# Altium project Power_PCB.PrjPcb
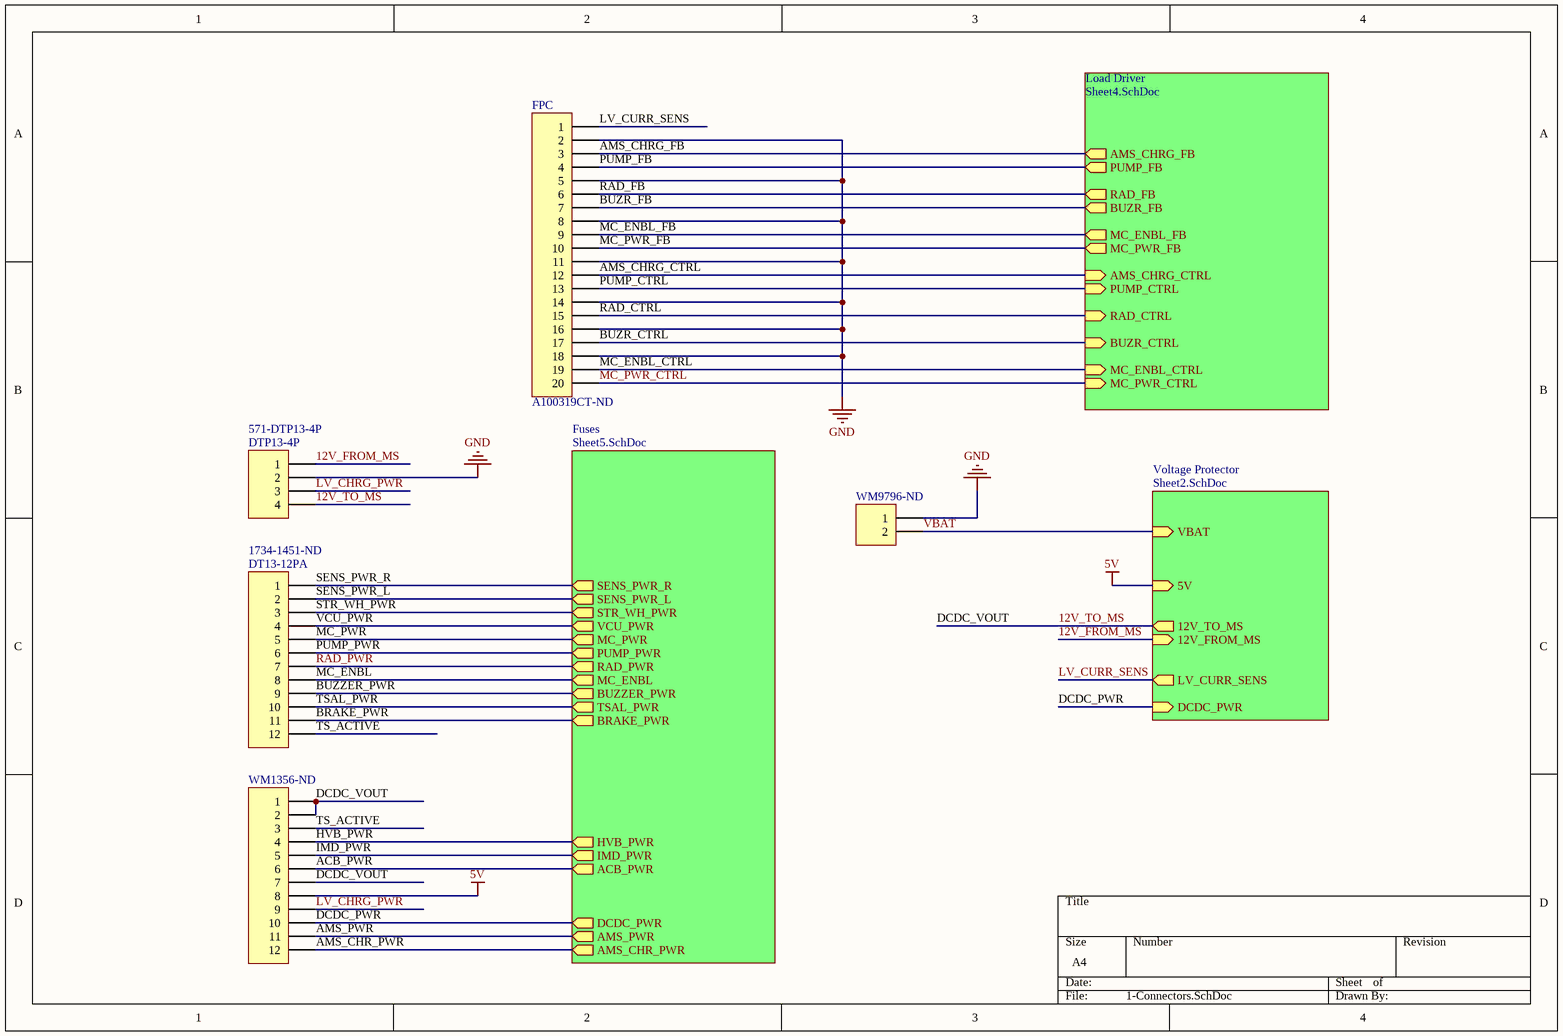
[diagram p0: 1-Connectors.SchDoc]
4 sheets, 95 parts. Net scope: global (net labels, ports and power ports of the same name join across sheets).
Board files: 2018_ACU_LVPWR_rev0.PcbDoc, 2018_ACU_LVPWR_rev1.PcbDoc, 2019_ACU_LVPWR_rev0.PcbDoc
Sheets:
  1-Connectors.SchDoc
  2-VoltProtector_CurrSens.SchDoc
  3-LoadDrivers.SchDoc
  4-Fuses.SchDoc

## Sheet 1-Connectors.SchDoc
size A4

### Parts
DT13-12PA  Supplier Part Number 2: 1734-1451-ND  [DT13-12PA]  (hidden comment: DT13-12PA)
DTP13-4P  Supplier Part Number 1: 571-DTP13-4P  [DTP13-4P]  (hidden comment: DTP13-4P)
FPC  Header 20  [A100319CT-ND]  (value not drawn)
WM1356-ND  Header 12  [WM1356-ND]  (value not drawn)
WM9796-ND  WM9796-ND  [WM9796-ND]  (value not drawn)

### Sub-sheets
Fuses = Sheet5.SchDoc (file not in this document): MC_ENBL (out), MC_PWR (out), VCU_PWR (out), BRAKE_PWR (out), BUZZER_PWR (out), TSAL_PWR (out), PUMP_PWR (out), ACB_PWR (out), IMD_PWR (out), AMS_CHR_PWR (out), HVB_PWR (out), AMS_PWR (out), STR_WH_PWR (out), SENS_PWR_L (out), SENS_PWR_R (out), RAD_PWR (out), DCDC_PWR (out)
Load Driver = Sheet4.SchDoc (file not in this document): RAD_CTRL (in), PUMP_CTRL (in), BUZR_FB (out), RAD_FB (out), AMS_CHRG_FB (out), PUMP_FB (out), MC_PWR_FB (out), MC_ENBL_FB (out), BUZR_CTRL (in), MC_ENBL_CTRL (in), AMS_CHRG_CTRL (in), MC_PWR_CTRL (in)
Voltage Protector = Sheet2.SchDoc (file not in this document): 12V_TO_MS (out), LV_CURR_SENS (out), 5V (in), 12V_FROM_MS (in), VBAT (in), DCDC_PWR (in)

### Nets
5V: WM1356-ND.8 ; sheet Voltage Protector/5V
GND: DTP13-4P.2 FPC.2 FPC.5 FPC.8 FPC.11 FPC.14 FPC.16 FPC.18 WM9796-ND.1
12V_FROM_MS: DTP13-4P.1 ; sheet Voltage Protector/12V_FROM_MS
12V_TO_MS: DTP13-4P.4 WM1356-ND.1 WM1356-ND.2 WM1356-ND.7 ; sheet Voltage Protector/12V_TO_MS  [also labelled DCDC_VOUT]
ACB_PWR: WM1356-ND.6 ; sheet Fuses/ACB_PWR
AMS_CHR_PWR: WM1356-ND.12 ; sheet Fuses/AMS_CHR_PWR
AMS_CHRG_CTRL: FPC.12 ; sheet Load Driver/AMS_CHRG_CTRL
AMS_CHRG_FB: FPC.3 ; sheet Load Driver/AMS_CHRG_FB
AMS_PWR: WM1356-ND.11 ; sheet Fuses/AMS_PWR
BRAKE_PWR: DT13-12PA.11 ; sheet Fuses/BRAKE_PWR
BUZR_CTRL: FPC.17 ; sheet Load Driver/BUZR_CTRL
BUZR_FB: FPC.7 ; sheet Load Driver/BUZR_FB
BUZZER_PWR: DT13-12PA.9 ; sheet Fuses/BUZZER_PWR
DCDC_PWR: WM1356-ND.10 ; sheet Voltage Protector/DCDC_PWR, sheet Fuses/DCDC_PWR
HVB_PWR: WM1356-ND.4 ; sheet Fuses/HVB_PWR
IMD_PWR: WM1356-ND.5 ; sheet Fuses/IMD_PWR
LV_CHRG_PWR: DTP13-4P.3 WM1356-ND.9
LV_CURR_SENS: FPC.1 ; sheet Voltage Protector/LV_CURR_SENS
MC_ENBL: DT13-12PA.8 ; sheet Fuses/MC_ENBL
MC_ENBL_CTRL: FPC.19 ; sheet Load Driver/MC_ENBL_CTRL
MC_ENBL_FB: FPC.9 ; sheet Load Driver/MC_ENBL_FB
MC_PWR: DT13-12PA.5 ; sheet Fuses/MC_PWR
MC_PWR_CTRL: FPC.20 ; sheet Load Driver/MC_PWR_CTRL
MC_PWR_FB: FPC.10 ; sheet Load Driver/MC_PWR_FB
PUMP_CTRL: FPC.13 ; sheet Load Driver/PUMP_CTRL
PUMP_FB: FPC.4 ; sheet Load Driver/PUMP_FB
PUMP_PWR: DT13-12PA.6 ; sheet Fuses/PUMP_PWR
RAD_CTRL: FPC.15 ; sheet Load Driver/RAD_CTRL
RAD_FB: FPC.6 ; sheet Load Driver/RAD_FB
RAD_PWR: DT13-12PA.7 ; sheet Fuses/RAD_PWR
SENS_PWR_L: DT13-12PA.2 ; sheet Fuses/SENS_PWR_L
SENS_PWR_R: DT13-12PA.1 ; sheet Fuses/SENS_PWR_R
STR_WH_PWR: DT13-12PA.3 ; sheet Fuses/STR_WH_PWR
TS_ACTIVE: DT13-12PA.12 WM1356-ND.3
TSAL_PWR: DT13-12PA.10 ; sheet Fuses/TSAL_PWR
VBAT: WM9796-ND.2 ; sheet Voltage Protector/VBAT
VCU_PWR: DT13-12PA.4 ; sheet Fuses/VCU_PWR

### Library data of the parts
DT13-12PA WM1356-ND = Header 12: Header, 12-Pin; LatestRevisionDate: 17-Jul-2002; LatestRevisionNote: Re-released for DXP Platform.; Publisher: Altium Limited; Supplier 1: Digi-Key
  DT13-12PA: Supplier Part Number 1: DT13-12PA; Supplier 2: Digi-Key
  WM1356-ND: Supplier Part Number 1: WM1356-ND
DTP13-4P = Header 4: Header, 4-Pin; LatestRevisionDate: 17-Jul-2002; LatestRevisionNote: Re-released for DXP Platform.; Publisher: Altium Limited; Supplier 1: Mouser
FPC = Header 20: Header, 20-Pin; LatestRevisionDate: 17-Jul-2002; LatestRevisionNote: Re-released for DXP Platform.; Publisher: Altium Limited; Supplier 1: Digi-Key; Supplier Part Number 1: A100319CT-ND
WM9796-ND = Header 2: Header, 2-Pin; LatestRevisionDate: 17-Jul-2002; LatestRevisionNote: Re-released for DXP Platform.; Publisher: Altium Limited; Supplier 1: Digi-Key; Supplier 2: Digi-Key; Supplier Part Number 2: WM9796-ND

## Sheet 2-VoltProtector_CurrSens.SchDoc
size A4
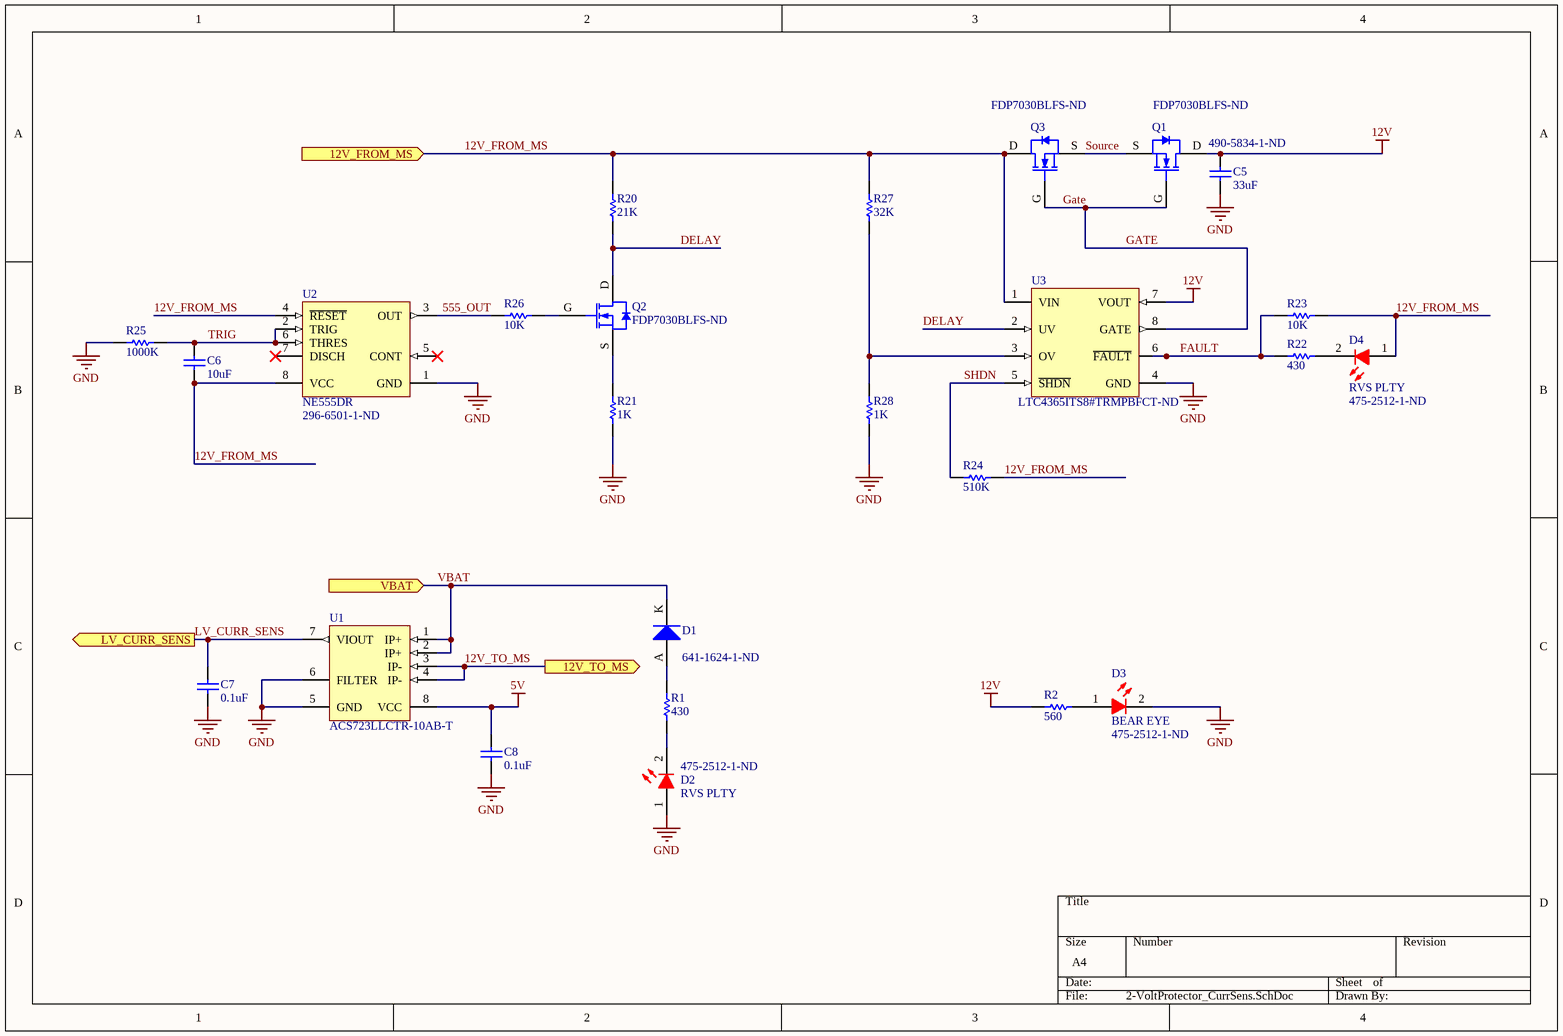
[diagram p1: 2-VoltProtector_CurrSens.SchDoc]

### Parts
C5  value 33uF  Supplier Part Number 1: 490-5834-1-ND  [2J-Lead 6.1 x 5.3]  (hidden comment: Cap Semi)
C6  value 10uF  [2J-Lead 6.1 x 5.3]  (hidden comment: Cap Semi)
C7  value 0.1uF  [1608[0603]]  (hidden comment: Cap Semi)
C8  value 0.1uF  [1608[0603]]  (hidden comment: Cap Semi)
D1  Supplier Part Number 1: 641-1624-1-ND  [SOD-123]
D2  RVS PLTY  Supplier Part Number 1: 475-2512-1-ND  [TOSH-0603LED_RED_V]
D3  BEAR EYE  Supplier Part Number 1: 475-2512-1-ND  [TOSH-0603LED_RED_V]
D4  RVS PLTY  Supplier Part Number 1: 475-2512-1-ND  [TOSH-0603LED_RED_V]
Q1  Supplier Part Number 1: FDP7030BLFS-ND  [TO220V-GDS]
Q2  Supplier Part Number 1: FDP7030BLFS-ND  [TO220V-GDS]
Q3  Supplier Part Number 1: FDP7030BLFS-ND  [TO220V-GDS]
R1  430  [RESC0603(1608)_L]
R2  560  [RESC0603(1608)_L]
R20  21K  [RESC0603(1608)_L]
R21  1K  [RESC0603(1608)_L]
R22  430  [RESC0603(1608)_L]
R23  10K  [RESC0603(1608)_L]
R24  510K  [RESC0603(1608)_L]
R25  1000K  [RESC0603(1608)_L]
R26  10K  [RESC0603(1608)_L]
R27  32K  [RESC0603(1608)_L]
R28  1K  [RESC0603(1608)_L]
U1  ACS723LLCTR-10AB-T  [ALEG-LC-8_V]
U2  NE555DR  Supplier Part Number 1: 296-6501-1-ND  [D0008A_M]
U3  Supplier Part Number 1: LTC4365ITS8#TRMPBFCT-ND  [LT-TS8-8-TSOT-23_V]  (hidden comment: LTC4365ITS8#TRMPBF)

### Ports
12V_FROM_MS (in), 12V_TO_MS (out), LV_CURR_SENS (out), VBAT (in)

### Nets
5V: C8.2 U1.8(VCC)
12V: C5.1 Q1.D R2.1 U3.7(VOUT)
GND: C5.2 C7.1 C8.1 D2.1(A) D3.2(K) R21.2 R25.2 R28.1 U1.5(GND) U1.6(FILTER) U2.1(GND) U3.4(GND)
12V_FROM_MS: C6.2 D4.1(A) Q3.D R20.1 R23.1 R24.1 R27.2 U2.4(~{RESET}) U2.8(VCC) U3.1(VIN) ; port 12V_FROM_MS
12V_TO_MS: U1.3(IP-) U1.4(IP-) ; port 12V_TO_MS
555_OUT: R26.2 U2.3(OUT)
DELAY: Q2.D R20.2 U3.2(UV)
FAULT: R22.1 R23.2 U3.6(~{FAULT})
GATE: Q1.G Q3.G U3.8(GATE)
LV_CURR_SENS: C7.2 U1.7(VIOUT) ; port LV_CURR_SENS
SHDN: R24.2 U3.5(~{SHDN})
Source: Q1.S Q3.S
TRIG: C6.1 R25.1 U2.2(TRIG) U2.6(THRES)
VBAT: D1.K U1.1(IP+) U1.2(IP+) ; port VBAT
NetD1_A: D1.A R1.2
NetD2_2: D2.2(K) R1.1
NetD3_1: D3.1(A) R2.2
NetD4_2: D4.2(K) R22.2
NetQ2_G: Q2.G R26.1
NetQ2_S: Q2.S R21.1
NetR27_1: R27.1 R28.2 U3.3(OV)

Not connected (* = marked no-connect by the designer): U2 5(CONT)* 7(DISCH)*

### Library data of the parts
C5-C8 = Cap Semi: Capacitor (Semiconductor SIM Model); Published: 8-Jun-2000; LatestRevisionDate: 29-May-2009; LatestRevisionNote: IPC-7351 Footprint Added.; PackageReference: C1206; Publisher: Altium Limited; PackageDescription: Chip Capacitor
  C5: Supplier 1: Digi-Key
  C7 C8: Supplier 1: Digi-Key; Supplier 2: Digi-Key; Supplier Part Number 2: 490-14359-1-ND
D1 = Diode 1N4003: 1 Amp General Purpose Rectifier; Published: 8-Jun-2000; LatestRevisionDate: 17-Jul-2002; LatestRevisionNote: Re-released for DXP Platform.; DatasheetVersion: 1998; PackageVersion: Aug-1999; PackageReference: DO-41; Publisher: Altium Limited; PackageDescription: Diode, Axial; Body 5.2 x 2.7 mm (LxDia. max), Lead Dia. 0.86 mm (max); Code_JEDEC: DO-204-AL; ComponentLink1Description: Manufacturer Link; ComponentLink1URL: http://www.fairchildsemi.com/; ComponentLink2Description: Datasheet; ComponentLink2URL: http://www.fairchildsemi.com/ds/1N%2F1N4001.pdf; Supplier 1: Digi-Key
D2-D4 = CMP-0444-00001-1: LED, Red 0603 (1608) 63mCd; Manufacturer: Toshiba; PartNumber: TLSU1008A(T04); Forward Current: 25 mA; Power Dissipation: 60 mW; Packing Type: Reel; Reverse Voltage: 4 V; Mounting Technology: Surface Mount; PackageDescription: 2-Pin SMT LED, 1.6 x 0.8 mm Pitch; ComponentLink1URL: http://www.toshiba-components.com/; ComponentLink1Description: Manufacturer URL; PackageReference: 0603LED_RED; ComponentLink2URL: http://www.semicon.toshiba.co.jp/info/docget.jsp?type=datasheet&lang=en&pid=TLSU1008A(T04); ComponentLink2Description: Datasheet; DatasheetVersion: Aug-08; Storage Temperature: -40 to 100 degC; Supplier 1: Digi-Key
Q1-Q3 = CMP-1058-00860-1: Power MOSFET, 40 V, 167 A, Single N-Channel, 3-Pin TO-220, Pb-Free, Tube; Qrr Typ (nC): 140; Channel Polarity: N Channel; Crss Typ (pF): 450; Ciss Typ (pF): 4300; Coss Typ (pF): 1075; ID Max (A): 167; PackageDescription: 3-Pin Flange Mount, Vertical Straight Lead, Body 9.97 x 4.445 mm, Pitch 2.54 mm; Configuration: Single; PackageVersion: Rev. AG, 09/2011; RoHS: Pb-Free; PackageReference: TO-220-3-221A-09; Package Type: TO-220-3; DatasheetVersion: Rev. 7; Packing: Tube; Mounting Technology: Through Hole; Supplier 1: Digi-Key
R1 R2 R20-R28 = CMP-1591-00001-1: 0603 (1608 Metric) Chip Resistor; Case-Metric: 1608; Case-EIA: 0603; PackageReference: RESC0603(1608)
  R1 R22: Supplier 1: Digi-Key; Supplier Part Number 1: P430BZCT-ND
  R2: Supplier 1: Digi-Key; Supplier Part Number 1: P560BZCT-ND
  R23 R26: Supplier 1: Digi-Key; Supplier Part Number 1: 311-10KGRCT-ND
  R25 R27 R28: Supplier 1: Digi-Key
U1 = CMP-0826-00001-1: Linear Current Sensor IC, 4.5 to 5.5 V Supply Voltage, 10 mA Supply Current, -40 to 85 degC, 8-Pin SOIC (LC), RoHS, Tape and Reel; Manufacturer: Allegro Microsystems; PartNumber: ACS712ELCTR-20A-T; CLOAD: 10 nF Max.; ICC: 10 mA; F: 80 kHz; RLOAD: 4.7 kOhm Min.; Optimized Accuracy Range: +/- 20 A; TR: 3.5 us; Sensitivity Sens: 100 mV/A Typ.; Operating Temperature Range: -40 to 85 degC; ComponentLink2URL: http://www.allegromicro.com/~/media/Files/Datasheets/ACS712-Datasheet.ashx; ComponentLink1Description: Manufacturer URL; VCC: 4.5 to 5.5 V; Mounting Technology: Surface Mount; DatasheetVersion: Rev. 15; ComponentLink2Description: Datasheet; ComponentLink1URL: http://www.allegromicro.com/; PackageDescription: 8-Pin SOIC, Body 4.9 x 3.9 mm, Pitch 1.27 mm; PackageReference: LC-8; RoHS: TRUE; Packing: Tape and Reel; Supplier 1: Digi-Key; Supplier Part Number 1: 620-1190-1-ND
U2 = CMP-1685-00007-1: Precision Timer, 4.5 to 16 V, 0 to 70 degC, 8-Pin SOIC (D8), Green (RoHS & no Sb/Br), Tape and Reel; Forward Voltage: 450 mV; Forward Current: 1 A; Max Surge Current: 30 A; Peak Reverse Current: 500 uA; Case\Package: SMA; PackageReference: D0008A; Width: 2.84 mm; PackageDescription: 8-Pin Small Outline Integrated Circuit, Body 4.9 x 3.9 mm, Pitch 1.27 mm; DatasheetVersion: SLFS022I, 09/2014; ComponentLink2Description: Datasheet; Package Quantity: 1; REACH SVHC: Unknown; Radiation Hardening: No; Height: 2.44 mm; Code_JEDEC: MS-012; Pins: 2; ComponentLink1Description: Manufacturer URL; ComponentLink3Description: Package Specification; ComponentLink3URL: http://www.ti.com/lit/ml/msoi002j/msoi002j.pdf; Length: 4.57 mm; ComponentLink1URL: http://www.ti.com/; Mount: Surface Mount; PackageVersion: 4040047-3/M, 06/2011; ComponentLink2URL: http://www.ti.com/general/docs/lit/getliterature.tsp?genericPartNumber=NE555&fileType=pdf; RoHSCompliant: true; Max Operating Temperature: 125 degC; Packaging: Cut Tape; Min Operating Temperature: -55 degC; Supplier 1: Digi-Key
U3 = CMP-0474-00861-1: UV, OV and Reverse Supply Protection Controller, 2.5 to 34 V Vin, 8-pin SOT23 (TS8-8), -40 to 85 degC, Pb-Free, Mini Tape and Reel; Manufacturer: Linear Technology; Fault: yes; Fast Comparator: no; Extended Temp: C, I, H; Circuit Breakers(#): 1; RoHS: TRUE; ComponentLink2URL: http://cds.linear.com/docs/en/datasheet/4365f.pdf; PartNumber: LTC4365ITS8#TRMPBF; ComponentLink3Description: Package Specification; Power Good: no; Packing: Mini Tape and Reel; ComponentLink2Description: Datasheet; Vin Range: 2.5 to 34 V; Active Limiting: no; Foldback: no; Reset: no; ComponentLink3URL: http://cds.linear.com/docs/en/packaging/SOT_8_05-08-1637.pdf; PackageVersion: Rev. A, 08/2010; Code_JEDEC: MO-193; ComponentLink1Description: Manufacturer URL; Mounting Technology: Surface Mount; ComponentLink1URL: http://www.linear.com/; PackageDescription: 8-Pin Plastic TSOT-23, Body 2.9 x 1.63 mm, Pitch 0.65 mm; PackageReference: TS8-8; Supplier 1: Digi-Key

## Sheet 3-LoadDrivers.SchDoc
size A4
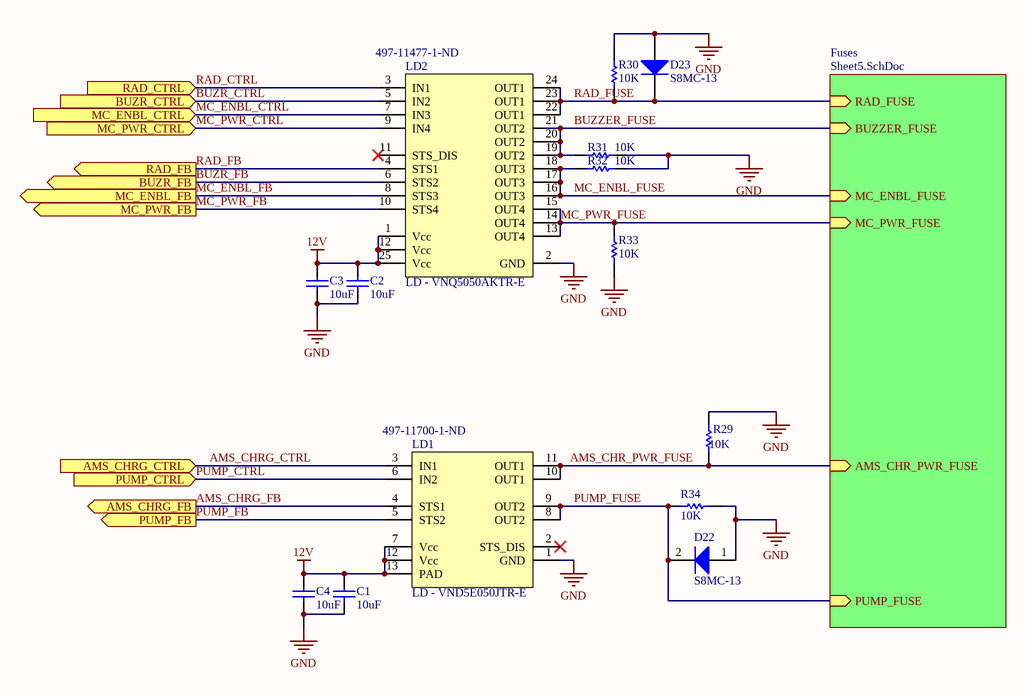
[diagram p2: 3-LoadDrivers.SchDoc]

### Parts
C1  value 10uF  [1608[0603]]  (hidden comment: Cap Semi)
C2  value 10uF  [1608[0603]]  (hidden comment: Cap Semi)
C3  value 10uF  [1608[0603]]  (hidden comment: Cap Semi)
C4  value 10uF  [1608[0603]]  (hidden comment: Cap Semi)
D22  S8MC-13  [S8MC-13]
D23  S8MC-13  [S8MC-13]
LD1  LD - VND5E050JTR-E  Supplier Part Number 1: 497-11700-1-ND
LD2  LD - VNQ5050AKTR-E  Supplier Part Number 1: 497-11477-1-ND  [24-SOP (0.295", 7.50mm Width) Exposed Pad]
R29  10K  [RESC0603(1608)_L]
R30  10K  [RESC0603(1608)_L]
R31  10K  [RESC0603(1608)_L]
R32  10K  [RESC0603(1608)_L]
R33  10K  [RESC0603(1608)_L]
R34  10K  [RESC0603(1608)_L]

### Sub-sheets
Fuses = Sheet5.SchDoc (file not in this document): RAD_FUSE (in), PUMP_FUSE (in), MC_PWR_FUSE (in), MC_ENBL_FUSE (in), BUZZER_FUSE (in), AMS_CHR_PWR_FUSE (in)

### Ports
AMS_CHRG_CTRL (in), AMS_CHRG_FB (out), BUZR_CTRL (in), BUZR_FB (out), MC_ENBL_CTRL (in), MC_ENBL_FB (out), MC_PWR_CTRL (in), MC_PWR_FB (out), PUMP_CTRL (in), PUMP_FB (out), RAD_CTRL (in), RAD_FB (out)

### Nets
12V: C1.2 C2.2 C3.2 C4.2 LD1.7(Vcc) LD1.12(Vcc) LD1.13(PAD) LD2.1(Vcc) LD2.12(Vcc) LD2.25(Vcc)
GND: C1.1 C2.1 C3.1 C4.1 D22.1(A) D23.1(A) LD1.1(GND) LD2.2(GND) R29.2 R30.2 R31.2 R32.2 R33.1 R34.1
AMS_CHR_PWR_FUSE: LD1.10(OUT1) LD1.11(OUT1) R29.1 ; sheet Fuses/AMS_CHR_PWR_FUSE
AMS_CHRG_CTRL: LD1.3(IN1) ; port AMS_CHRG_CTRL
AMS_CHRG_FB: LD1.4(STS1) ; port AMS_CHRG_FB
BUZR_CTRL: LD2.5(IN2) ; port BUZR_CTRL
BUZR_FB: LD2.6(STS2) ; port BUZR_FB
BUZZER_FUSE: LD2.19(OUT2) LD2.20(OUT2) LD2.21(OUT2) R31.1 ; sheet Fuses/BUZZER_FUSE
MC_ENBL_CTRL: LD2.7(IN3) ; port MC_ENBL_CTRL
MC_ENBL_FB: LD2.8(STS3) ; port MC_ENBL_FB
MC_ENBL_FUSE: LD2.16(OUT3) LD2.17(OUT3) LD2.18(OUT3) R32.1 ; sheet Fuses/MC_ENBL_FUSE
MC_PWR_CTRL: LD2.9(IN4) ; port MC_PWR_CTRL
MC_PWR_FB: LD2.10(STS4) ; port MC_PWR_FB
MC_PWR_FUSE: LD2.13(OUT4) LD2.14(OUT4) LD2.15(OUT4) R33.2 ; sheet Fuses/MC_PWR_FUSE
PUMP_CTRL: LD1.6(IN2) ; port PUMP_CTRL
PUMP_FB: LD1.5(STS2) ; port PUMP_FB
PUMP_FUSE: D22.2(K) LD1.8(OUT2) LD1.9(OUT2) R34.2 ; sheet Fuses/PUMP_FUSE
RAD_CTRL: LD2.3(IN1) ; port RAD_CTRL
RAD_FB: LD2.4(STS1) ; port RAD_FB
RAD_FUSE: D23.2(K) LD2.22(OUT1) LD2.23(OUT1) LD2.24(OUT1) R30.1 ; sheet Fuses/RAD_FUSE

Not connected (* = marked no-connect by the designer): LD1 2(STS_DIS)*; LD2 11(STS_DIS)*

### Library data of the parts
C1-C4 = Cap Semi: Capacitor (Semiconductor SIM Model); Published: 8-Jun-2000; LatestRevisionDate: 29-May-2009; LatestRevisionNote: IPC-7351 Footprint Added.; PackageReference: C1206; Publisher: Altium Limited; PackageDescription: Chip Capacitor; Supplier 1: Digi-Key; Supplier Part Number 1: 490-10991-1-ND
D22 D23 = Diode: Default Diode; Supplier 1: Digi-Key; Supplier Part Number 1: S8MCDICT-ND
LD1 = LOAD DRIVER - VND5E050JTR-E: Supplier 1: Digi-Key
LD2 = LOAD DRIVER - VNQ5050: Supplier 1: Digi-Key
R29-R34 = CMP-1591-00001-1: as R1 on sheet 2-VoltProtector_CurrSens; PackageReference: RESC0603(1608); Supplier 1: Digi-Key; Supplier Part Number 1: 311-10KGRCT-ND

## Sheet 4-Fuses.SchDoc
size A4
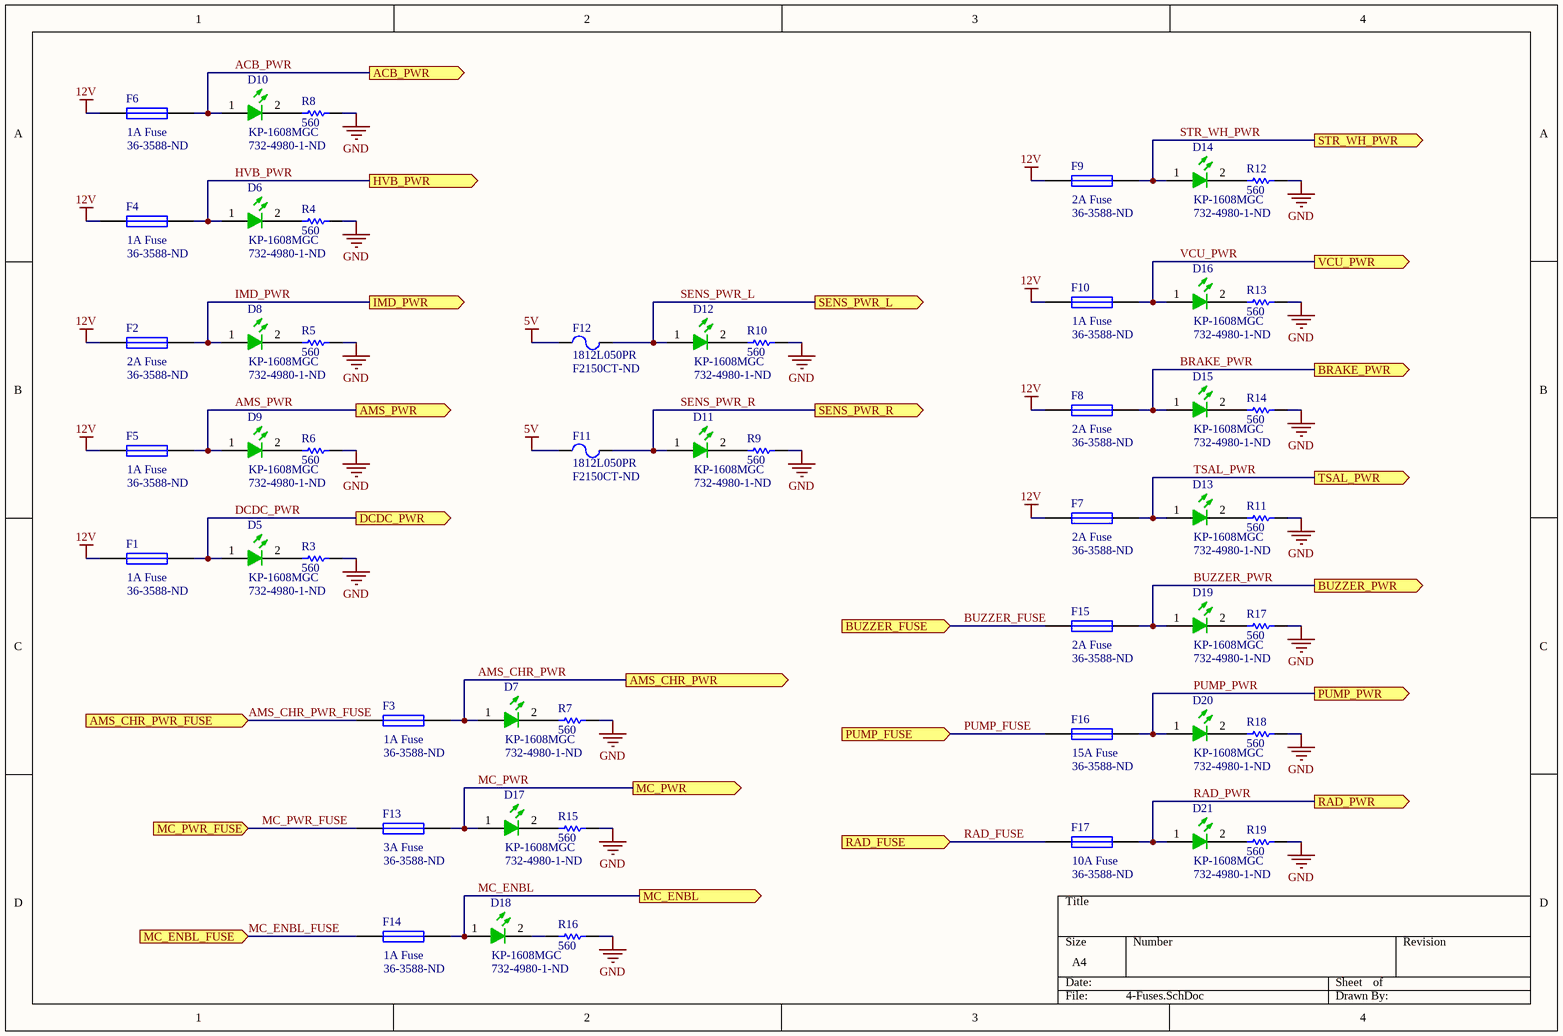
[diagram p3: 4-Fuses.SchDoc]

### Parts
D5  KP-1608MGC  Supplier Part Number 1: 732-4980-1-ND  [KING-0603LED_GREEN_V]
D6  KP-1608MGC  Supplier Part Number 1: 732-4980-1-ND  [KING-0603LED_GREEN_V]
D7  KP-1608MGC  Supplier Part Number 1: 732-4980-1-ND  [KING-0603LED_GREEN_V]
D8  KP-1608MGC  Supplier Part Number 1: 732-4980-1-ND  [KING-0603LED_GREEN_V]
D9  KP-1608MGC  Supplier Part Number 1: 732-4980-1-ND  [KING-0603LED_GREEN_V]
D10  KP-1608MGC  Supplier Part Number 1: 732-4980-1-ND  [KING-0603LED_GREEN_V]
D11  KP-1608MGC  Supplier Part Number 1: 732-4980-1-ND  [KING-0603LED_GREEN_V]
D12  KP-1608MGC  Supplier Part Number 1: 732-4980-1-ND  [KING-0603LED_GREEN_V]
D13  KP-1608MGC  Supplier Part Number 1: 732-4980-1-ND  [KING-0603LED_GREEN_V]
D14  KP-1608MGC  Supplier Part Number 1: 732-4980-1-ND  [KING-0603LED_GREEN_V]
D15  KP-1608MGC  Supplier Part Number 1: 732-4980-1-ND  [KING-0603LED_GREEN_V]
D16  KP-1608MGC  Supplier Part Number 1: 732-4980-1-ND  [KING-0603LED_GREEN_V]
D17  KP-1608MGC  Supplier Part Number 1: 732-4980-1-ND  [KING-0603LED_GREEN_V]
D18  KP-1608MGC  Supplier Part Number 1: 732-4980-1-ND  [KING-0603LED_GREEN_V]
D19  KP-1608MGC  Supplier Part Number 1: 732-4980-1-ND  [KING-0603LED_GREEN_V]
D20  KP-1608MGC  Supplier Part Number 1: 732-4980-1-ND  [KING-0603LED_GREEN_V]
D21  KP-1608MGC  Supplier Part Number 1: 732-4980-1-ND  [KING-0603LED_GREEN_V]
F1  1A Fuse  Supplier Part Number 1: 36-3588-ND  [FUSE 3588 Holder]
F2  2A Fuse  Supplier Part Number 1: 36-3588-ND  [FUSE 3588 Holder]
F3  1A Fuse  Supplier Part Number 1: 36-3588-ND  [FUSE 3588 Holder]
F4  1A Fuse  Supplier Part Number 1: 36-3588-ND  [FUSE 3588 Holder]
F5  1A Fuse  Supplier Part Number 1: 36-3588-ND  [FUSE 3588 Holder]
F6  1A Fuse  Supplier Part Number 1: 36-3588-ND  [FUSE 3588 Holder]
F7  2A Fuse  Supplier Part Number 1: 36-3588-ND  [FUSE 3588 Holder]
F8  2A Fuse  Supplier Part Number 1: 36-3588-ND  [FUSE 3588 Holder]
F9  2A Fuse  Supplier Part Number 1: 36-3588-ND  [FUSE 3588 Holder]
F10  1A Fuse  Supplier Part Number 1: 36-3588-ND  [FUSE 3588 Holder]
F11  1812L050PR  Supplier Part Number 1: F2150CT-ND  [LFUS-1812L050_V]
F12  1812L050PR  Supplier Part Number 1: F2150CT-ND  [LFUS-1812L050_V]
F13  3A Fuse  Supplier Part Number 1: 36-3588-ND  [FUSE 3588 Holder]
F14  1A Fuse  Supplier Part Number 1: 36-3588-ND  [FUSE 3588 Holder]
F15  2A Fuse  Supplier Part Number 1: 36-3588-ND  [FUSE 3588 Holder]
F16  15A Fuse  Supplier Part Number 1: 36-3588-ND  [FUSE 3588 Holder]
F17  10A Fuse  Supplier Part Number 1: 36-3588-ND  [FUSE 3588 Holder]
R3  560  [RESC0603(1608)_L]
R4  560  [RESC0603(1608)_L]
R5  560  [RESC0603(1608)_L]
R6  560  [RESC0603(1608)_L]
R7  560  [RESC0603(1608)_L]
R8  560  [RESC0603(1608)_L]
R9  560  [RESC0603(1608)_L]
R10  560  [RESC0603(1608)_L]
R11  560  [RESC0603(1608)_L]
R12  560  [RESC0603(1608)_L]
R13  560  [RESC0603(1608)_L]
R14  560  [RESC0603(1608)_L]
R15  560  [RESC0603(1608)_L]
R16  560  [RESC0603(1608)_L]
R17  560  [RESC0603(1608)_L]
R18  560  [RESC0603(1608)_L]
R19  560  [RESC0603(1608)_L]

### Ports
ACB_PWR (out), AMS_CHR_PWR (out), AMS_CHR_PWR_FUSE (in), AMS_PWR (out), BRAKE_PWR (out), BUZZER_FUSE (in), BUZZER_PWR (out), DCDC_PWR (out), HVB_PWR (out), IMD_PWR (out), MC_ENBL (out), MC_ENBL_FUSE (in), MC_PWR (out), MC_PWR_FUSE (in), PUMP_FUSE (in), PUMP_PWR (out), RAD_FUSE (in), RAD_PWR (out), SENS_PWR_L (out), SENS_PWR_R (out), STR_WH_PWR (out), TSAL_PWR (out), VCU_PWR (out)

### Nets
5V: F11.1 F12.1
12V: F1.1 F2.1 F4.1 F5.1 F6.1 F7.1 F8.1 F9.1 F10.1
GND: R3.2 R4.2 R5.2 R6.2 R7.2 R8.2 R9.2 R10.2 R11.2 R12.2 R13.2 R14.2 R15.2 R16.2 R17.2 R18.2 R19.2
ACB_PWR: D10.1(A) F6.2 ; port ACB_PWR
AMS_CHR_PWR: D7.1(A) F3.2 ; port AMS_CHR_PWR
AMS_CHR_PWR_FUSE: F3.1 ; port AMS_CHR_PWR_FUSE
AMS_PWR: D9.1(A) F5.2 ; port AMS_PWR
BRAKE_PWR: D15.1(A) F8.2 ; port BRAKE_PWR
BUZZER_FUSE: F15.1 ; port BUZZER_FUSE
BUZZER_PWR: D19.1(A) F15.2 ; port BUZZER_PWR
DCDC_PWR: D5.1(A) F1.2 ; port DCDC_PWR
HVB_PWR: D6.1(A) F4.2 ; port HVB_PWR
IMD_PWR: D8.1(A) F2.2 ; port IMD_PWR
MC_ENBL: D18.1(A) F14.2 ; port MC_ENBL
MC_ENBL_FUSE: F14.1 ; port MC_ENBL_FUSE
MC_PWR: D17.1(A) F13.2 ; port MC_PWR
MC_PWR_FUSE: F13.1 ; port MC_PWR_FUSE
PUMP_FUSE: F16.1 ; port PUMP_FUSE
PUMP_PWR: D20.1(A) F16.2 ; port PUMP_PWR
RAD_FUSE: F17.1 ; port RAD_FUSE
RAD_PWR: D21.1(A) F17.2 ; port RAD_PWR
SENS_PWR_L: D12.1(A) F12.2 ; port SENS_PWR_L
SENS_PWR_R: D11.1(A) F11.2 ; port SENS_PWR_R
STR_WH_PWR: D14.1(A) F9.2 ; port STR_WH_PWR
TSAL_PWR: D13.1(A) F7.2 ; port TSAL_PWR
VCU_PWR: D16.1(A) F10.2 ; port VCU_PWR
NetD5_2: D5.2(K) R3.1
NetD6_2: D6.2(K) R4.1
NetD7_2: D7.2(K) R7.1
NetD8_2: D8.2(K) R5.1
NetD9_2: D9.2(K) R6.1
NetD10_2: D10.2(K) R8.1
NetD11_2: D11.2(K) R9.1
NetD12_2: D12.2(K) R10.1
NetD13_2: D13.2(K) R11.1
NetD14_2: D14.2(K) R12.1
NetD15_2: D15.2(K) R14.1
NetD16_2: D16.2(K) R13.1
NetD17_2: D17.2(K) R15.1
NetD18_2: D18.2(K) R16.1
NetD19_2: D19.2(K) R17.1
NetD20_2: D20.2(K) R18.1
NetD21_2: D21.2(K) R19.1

### Library data of the parts
D5-D21 = CMP-0404-00001-1: LED, SMT, 0603(1608), 1.1mm thickness, Green; Manufacturer: Kingbright; Reverse Voltage: 5 V; Power Dissipation: 75 mW; Forward Current: 30 mA; Packing Type: 2000 pcs / reel; Mounting Technology: Surface Mount; Storage Temperature: -40 to +85 degC; ComponentLink1URL: http://www.kingbright.com/; PackageDescription: 2-Pin SMT LED, 1.6 x 0.8 mm Pitch; PartNumber: KP-1608MGC; PackageReference: 0603LED_GREEN; ComponentLink1Description: Manufacturer URL; Supplier 1: Digi-Key
F1-F10 F13-F17 = Fuse 1: Fuse; Published: 8-Jun-2000; LatestRevisionDate: 17-Jul-2002; LatestRevisionNote: Re-released for DXP Platform.; PackageReference: PIN-W2/E2.8; Publisher: Altium Limited; PackageDescription: Thru-Hole; 2 Leads; Supplier 1: Digi-Key
F11 F12 = CMP-1700-00002-1: POLY-FUSE(R) Resettable PTC, 0.5 A, 0.15 to 1 Ohm Resistance, -40 to 85 degC, 1812 (4532 Metric), RoHS, Tape and Reel; Voltage Rating: 50 V; Power Rating: 100 mW; Resistance: 150 kohm; Tolerance: 1%; Case\Package: 0603; ComponentLink2URL: http://www.littelfuse.com/~/media/electronics/datasheets/resettable_ptcs/littelfuse_ptc_1812l_datasheet.pdf.pdf; Pins: 2; Mount: Surface Mount; Width: 0.8 mm; Length: 1.6 mm; Package Quantity: 1; Max Operating Temperature: 155 degC; Case Code (Imperial): 0603; ComponentLink1Description: Manufacturer URL; PackageReference: 1812; ComponentLink1URL: http://www.littelfuse.com/; RoHSCompliant: true; Voltage Rating (DC): 50 V; Packaging: Tape and Reel; PackageDescription: 2-Pin Surface Mount Device, Body 4.55 x 3.24 mm; Min Operating Temperature: -55 degC; DatasheetVersion: Feb-16; REACH SVHC: No SVHC; Case Code (Metric): 1608; ComponentLink2Description: Datasheet; Height: 0.45 mm; Supplier 1: Digi-Key
R3-R19 = CMP-1591-00001-1: as R1 on sheet 2-VoltProtector_CurrSens; PackageReference: RESC0603(1608); Supplier 1: Digi-Key; Supplier Part Number 1: P560BZCT-ND

## Nets that join several sheets
5V: 1-Connectors (WM1356-ND.8), 2-VoltProtector_CurrSens (C8.2 U1.8), 4-Fuses (F11.1 F12.1)
12V: 2-VoltProtector_CurrSens (C5.1 Q1.D R2.1 U3.7), 3-LoadDrivers (10 pins), 4-Fuses (9 pins)
GND: 1-Connectors (9 pins), 2-VoltProtector_CurrSens (12 pins), 3-LoadDrivers (14 pins), 4-Fuses (17 pins)
12V_FROM_MS: 1-Connectors (DTP13-4P.1), 2-VoltProtector_CurrSens (10 pins)
12V_TO_MS: 1-Connectors (DTP13-4P.4 WM1356-ND.1 WM1356-ND.2 WM1356-ND.7), 2-VoltProtector_CurrSens (U1.3 U1.4)
ACB_PWR: 1-Connectors (WM1356-ND.6), 4-Fuses (D10.1 F6.2)
AMS_CHR_PWR: 1-Connectors (WM1356-ND.12), 4-Fuses (D7.1 F3.2)
AMS_CHR_PWR_FUSE: 3-LoadDrivers (LD1.10 LD1.11 R29.1), 4-Fuses (F3.1)
AMS_CHRG_CTRL: 1-Connectors (FPC.12), 3-LoadDrivers (LD1.3)
AMS_CHRG_FB: 1-Connectors (FPC.3), 3-LoadDrivers (LD1.4)
AMS_PWR: 1-Connectors (WM1356-ND.11), 4-Fuses (D9.1 F5.2)
BRAKE_PWR: 1-Connectors (DT13-12PA.11), 4-Fuses (D15.1 F8.2)
BUZR_CTRL: 1-Connectors (FPC.17), 3-LoadDrivers (LD2.5)
BUZR_FB: 1-Connectors (FPC.7), 3-LoadDrivers (LD2.6)
BUZZER_FUSE: 3-LoadDrivers (LD2.19 LD2.20 LD2.21 R31.1), 4-Fuses (F15.1)
BUZZER_PWR: 1-Connectors (DT13-12PA.9), 4-Fuses (D19.1 F15.2)
DCDC_PWR: 1-Connectors (WM1356-ND.10), 4-Fuses (D5.1 F1.2)
HVB_PWR: 1-Connectors (WM1356-ND.4), 4-Fuses (D6.1 F4.2)
IMD_PWR: 1-Connectors (WM1356-ND.5), 4-Fuses (D8.1 F2.2)
LV_CURR_SENS: 1-Connectors (FPC.1), 2-VoltProtector_CurrSens (C7.2 U1.7)
MC_ENBL: 1-Connectors (DT13-12PA.8), 4-Fuses (D18.1 F14.2)
MC_ENBL_CTRL: 1-Connectors (FPC.19), 3-LoadDrivers (LD2.7)
MC_ENBL_FB: 1-Connectors (FPC.9), 3-LoadDrivers (LD2.8)
MC_ENBL_FUSE: 3-LoadDrivers (LD2.16 LD2.17 LD2.18 R32.1), 4-Fuses (F14.1)
MC_PWR: 1-Connectors (DT13-12PA.5), 4-Fuses (D17.1 F13.2)
MC_PWR_CTRL: 1-Connectors (FPC.20), 3-LoadDrivers (LD2.9)
MC_PWR_FB: 1-Connectors (FPC.10), 3-LoadDrivers (LD2.10)
MC_PWR_FUSE: 3-LoadDrivers (LD2.13 LD2.14 LD2.15 R33.2), 4-Fuses (F13.1)
PUMP_CTRL: 1-Connectors (FPC.13), 3-LoadDrivers (LD1.6)
PUMP_FB: 1-Connectors (FPC.4), 3-LoadDrivers (LD1.5)
PUMP_FUSE: 3-LoadDrivers (D22.2 LD1.8 LD1.9 R34.2), 4-Fuses (F16.1)
PUMP_PWR: 1-Connectors (DT13-12PA.6), 4-Fuses (D20.1 F16.2)
RAD_CTRL: 1-Connectors (FPC.15), 3-LoadDrivers (LD2.3)
RAD_FB: 1-Connectors (FPC.6), 3-LoadDrivers (LD2.4)
RAD_FUSE: 3-LoadDrivers (5 pins), 4-Fuses (F17.1)
RAD_PWR: 1-Connectors (DT13-12PA.7), 4-Fuses (D21.1 F17.2)
SENS_PWR_L: 1-Connectors (DT13-12PA.2), 4-Fuses (D12.1 F12.2)
SENS_PWR_R: 1-Connectors (DT13-12PA.1), 4-Fuses (D11.1 F11.2)
STR_WH_PWR: 1-Connectors (DT13-12PA.3), 4-Fuses (D14.1 F9.2)
TSAL_PWR: 1-Connectors (DT13-12PA.10), 4-Fuses (D13.1 F7.2)
VBAT: 1-Connectors (WM9796-ND.2), 2-VoltProtector_CurrSens (D1.K U1.1 U1.2)
VCU_PWR: 1-Connectors (DT13-12PA.4), 4-Fuses (D16.1 F10.2)